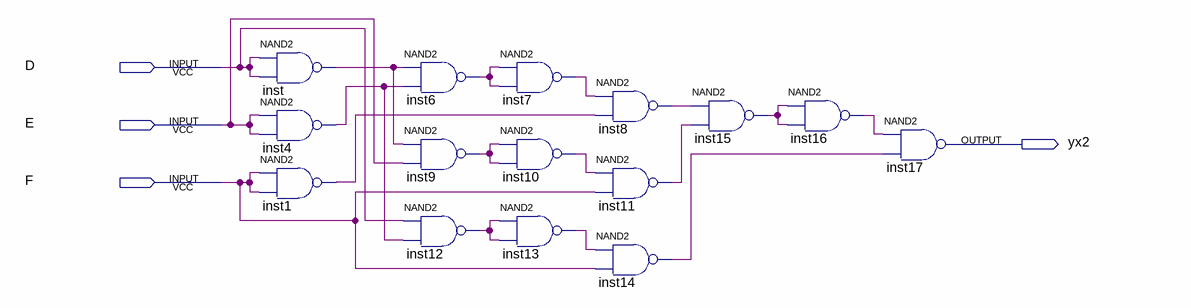
[diagram p0: schematic sheet]
// Quartus schematic DZ1_Quartus_DC_RE_yx2.bdf as structural Verilog: 15 symbols, 4 pins
module DZ1_Quartus_DC_RE_yx2 (
  input  D,
  input  E,
  input  F,
  output yx2
);

  wire inst1_out, inst4_out, inst6_out, inst7_out, inst8_out, inst9_out, inst10_out, inst11_out, inst12_out,
       inst13_out, inst14_out, inst15_out, inst16_out, inst_out;

  nand inst (inst_out, D, D);
  nand inst4 (inst4_out, E, E);
  nand inst1 (inst1_out, F, F);
  nand inst6 (inst6_out, inst_out, inst4_out);
  nand inst9 (inst9_out, inst_out, E);
  nand inst12 (inst12_out, D, inst4_out);
  nand inst7 (inst7_out, inst6_out, inst6_out);
  nand inst10 (inst10_out, inst9_out, inst9_out);
  nand inst13 (inst13_out, inst12_out, inst12_out);
  nand inst8 (inst8_out, inst7_out, inst1_out);
  nand inst11 (inst11_out, inst10_out, F);
  nand inst14 (inst14_out, inst13_out, F);
  nand inst15 (inst15_out, inst8_out, inst11_out);
  nand inst16 (inst16_out, inst15_out, inst15_out);
  nand inst17 (yx2, inst16_out, inst14_out);
endmodule
